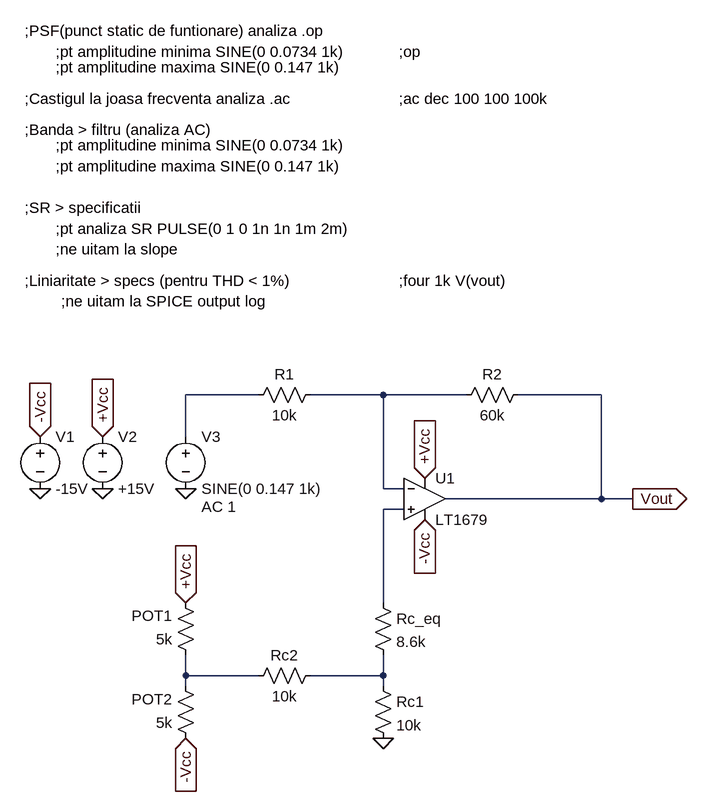
[diagram p0: schematic ProiectSCIA_Etaj1_Finalizat.asc]
ProiectSCIA_Etaj1_Finalizat.asc, the LTspice schematic file:
Version 4.1
SHEET 1 896 680
WIRE 208 -96 96 -96
WIRE 400 -96 288 -96
WIRE 528 -96 400 -96
WIRE 736 -96 608 -96
WIRE 96 -32 96 -96
WIRE 400 48 400 -96
WIRE 432 48 400 48
WIRE 736 64 736 -96
WIRE 736 64 496 64
WIRE 784 64 736 64
WIRE 432 80 400 80
WIRE 400 224 400 80
WIRE 96 336 96 304
WIRE 208 336 96 336
WIRE 400 336 400 304
WIRE 400 336 288 336
WIRE 96 352 96 336
WIRE 400 352 400 336
FLAG 464 32 +Vcc
IOPIN 464 32 In
FLAG -32 -32 +Vcc
IOPIN -32 -32 In
FLAG -128 -32 -Vcc
IOPIN -128 -32 In
FLAG 464 96 -Vcc
IOPIN 464 96 In
FLAG -128 48 0
FLAG -32 48 0
FLAG 96 48 0
FLAG 400 432 0
FLAG 96 224 +Vcc
IOPIN 96 224 In
FLAG 96 432 -Vcc
IOPIN 96 432 In
FLAG 784 64 Vout
IOPIN 784 64 Out
SYMBOL voltage -128 -48 R0
WINDOW 123 0 0 Left 0
WINDOW 39 0 0 Left 0
SYMATTR InstName V1
SYMATTR Value -15V
SYMBOL voltage -32 -48 R0
WINDOW 123 0 0 Left 0
WINDOW 39 0 0 Left 0
SYMATTR InstName V2
SYMATTR Value +15V
SYMBOL voltage 96 -48 R0
WINDOW 123 24 124 Left 2
WINDOW 39 0 0 Left 0
SYMATTR InstName V3
SYMATTR Value SINE(0 0.147 1k)
SYMATTR Value2 AC 1
SYMBOL res 304 -112 R90
WINDOW 0 0 56 VBottom 2
WINDOW 3 32 56 VTop 2
SYMATTR InstName R1
SYMATTR Value 10k
SYMBOL res 624 -112 R90
WINDOW 0 0 56 VBottom 2
WINDOW 3 32 56 VTop 2
SYMATTR InstName R2
SYMATTR Value 60k
SYMBOL OpAmps\\LT1679 464 64 R0
SYMATTR InstName U1
SYMBOL res 384 208 R0
SYMATTR InstName Rc_eq
SYMATTR Value 8.6k
SYMBOL res 304 320 R90
WINDOW 0 0 56 VBottom 2
WINDOW 3 32 56 VTop 2
SYMATTR InstName Rc2
SYMATTR Value 10k
SYMBOL res 112 320 R180
WINDOW 0 36 76 Left 2
WINDOW 3 36 40 Left 2
SYMATTR InstName POT1
SYMATTR Value 5k
SYMBOL res 112 448 R180
WINDOW 0 36 76 Left 2
WINDOW 3 36 40 Left 2
SYMATTR InstName POT2
SYMATTR Value 5k
SYMBOL res 384 336 R0
SYMATTR InstName Rc1
SYMATTR Value 10k
TEXT -152 -656 Left 2 !;PSF(punct static de funtionare) analiza .op
TEXT -152 -552 Left 2 !;Castigul la joasa frecventa analiza .ac
TEXT -104 -624 Left 2 !;pt amplitudine minima SINE(0 0.0734 1k)
TEXT -104 -600 Left 2 !;pt amplitudine maxima SINE(0 0.147 1k)
TEXT 424 -624 Left 2 !;op
TEXT 424 -552 Left 2 !;ac dec 100 100 100k
TEXT -152 -504 Left 2 !;Banda > filtru (analiza AC)
TEXT -104 -480 Left 2 !;pt amplitudine minima SINE(0 0.0734 1k)
TEXT -104 -448 Left 2 !;pt amplitudine maxima SINE(0 0.147 1k)
TEXT -152 -384 Left 2 !;SR > specificatii
TEXT -104 -352 Left 2 !;pt analiza SR PULSE(0 1 0 1n 1n 1m 2m)
TEXT -104 -320 Left 2 !;ne uitam la slope
TEXT -152 -272 Left 2 !;Liniaritate > specs (pentru THD < 1%)
TEXT 424 -272 Left 2 !;four 1k V(vout)
TEXT -96 -240 Left 2 !;ne uitam la SPICE output log

The netlist it stands for:
* ProiectSCIA_Etaj1_Finalizat.asc
V1 -Vcc 0 -15V
V2 +Vcc 0 +15V
V3 N001 0 SINE(0 0.147 1k) AC 1
R1 N002 N001 10k
R2 Vout N002 60k
* U1: LT1679 (symbol OpAmps\LT1679 not available, pins judged from their places): In+=N003 In-=N002 V+=+Vcc V-=-Vcc OUT=Vout
Rc_eq N003 N005 8.6k
Rc2 N005 N004 10k
R§POT1 N004 +Vcc 5k
R§POT2 -Vcc N004 5k
Rc1 N005 0 10k
;PSF(punct static de funtionare) analiza .op
;Castigul la joasa frecventa analiza .ac
;pt amplitudine minima SINE(0 0.0734 1k)
;pt amplitudine maxima SINE(0 0.147 1k)
;op
;ac dec 100 100 100k
;Banda > filtru (analiza AC)
;pt amplitudine minima SINE(0 0.0734 1k)
;pt amplitudine maxima SINE(0 0.147 1k)
;SR > specificatii
;pt analiza SR PULSE(0 1 0 1n 1n 1m 2m)
;ne uitam la slope
;Liniaritate > specs (pentru THD < 1%)
;four 1k V(vout)
;ne uitam la SPICE output log
.backanno
.end